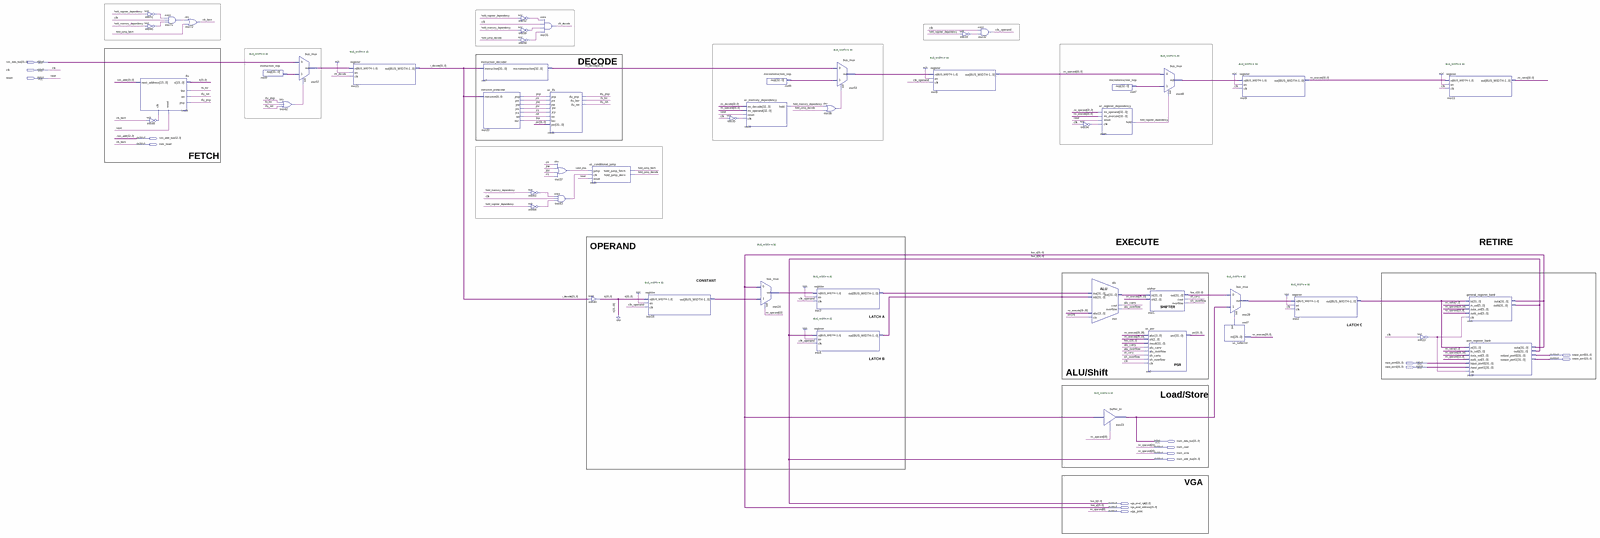
[diagram p0: schematic sheet, whole]
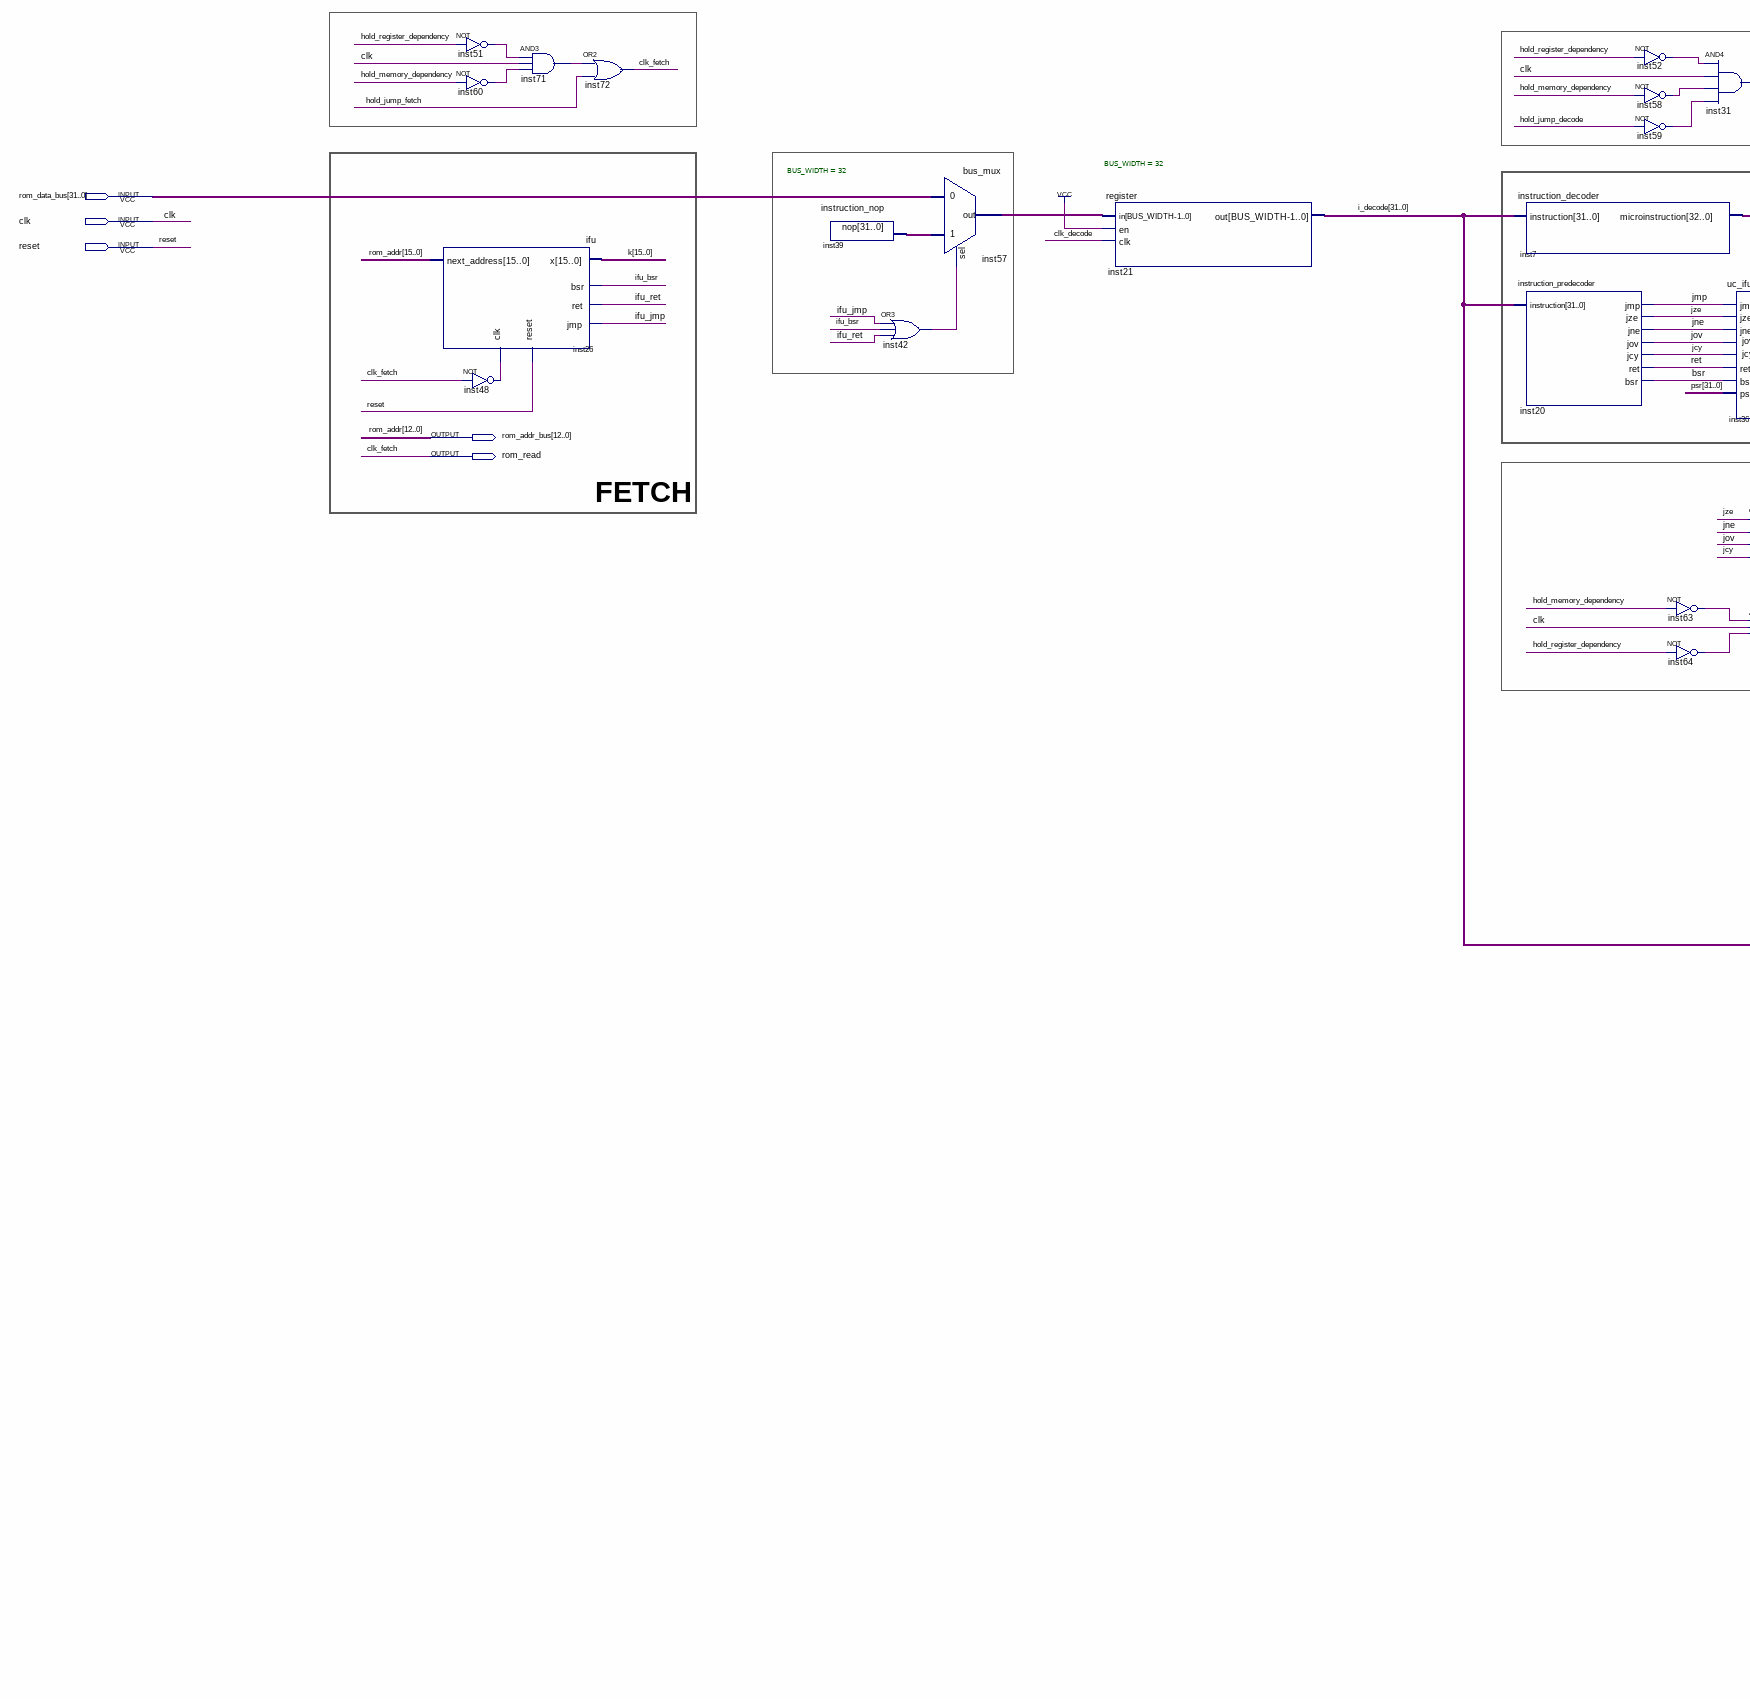
[diagram p1: schematic sheet, left part]
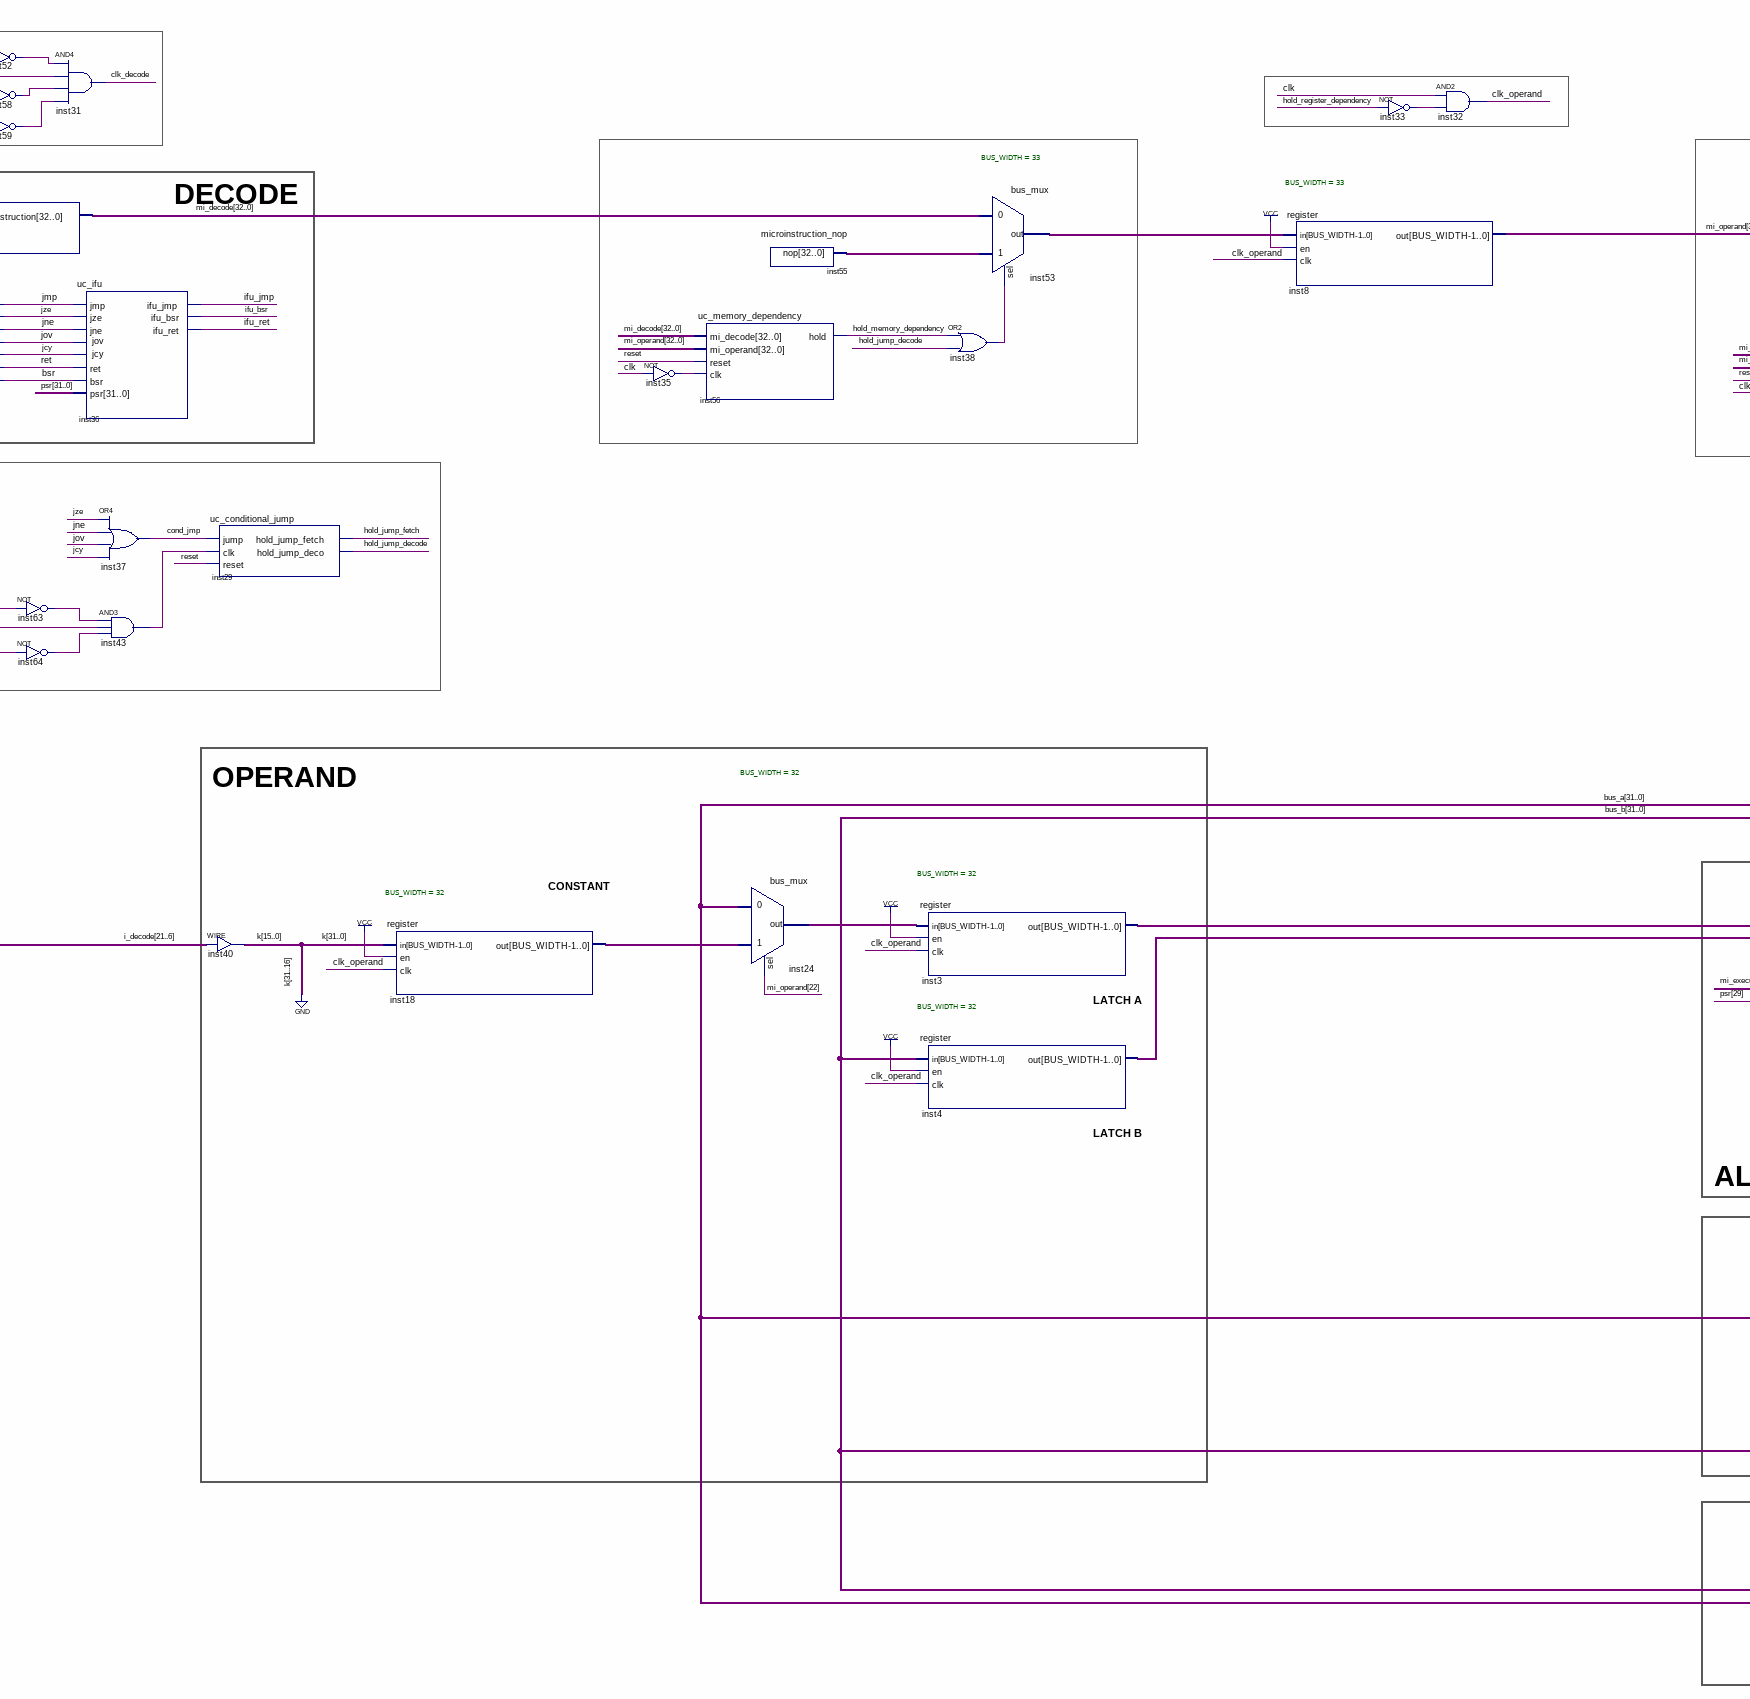
[diagram p2: schematic sheet, centre part]
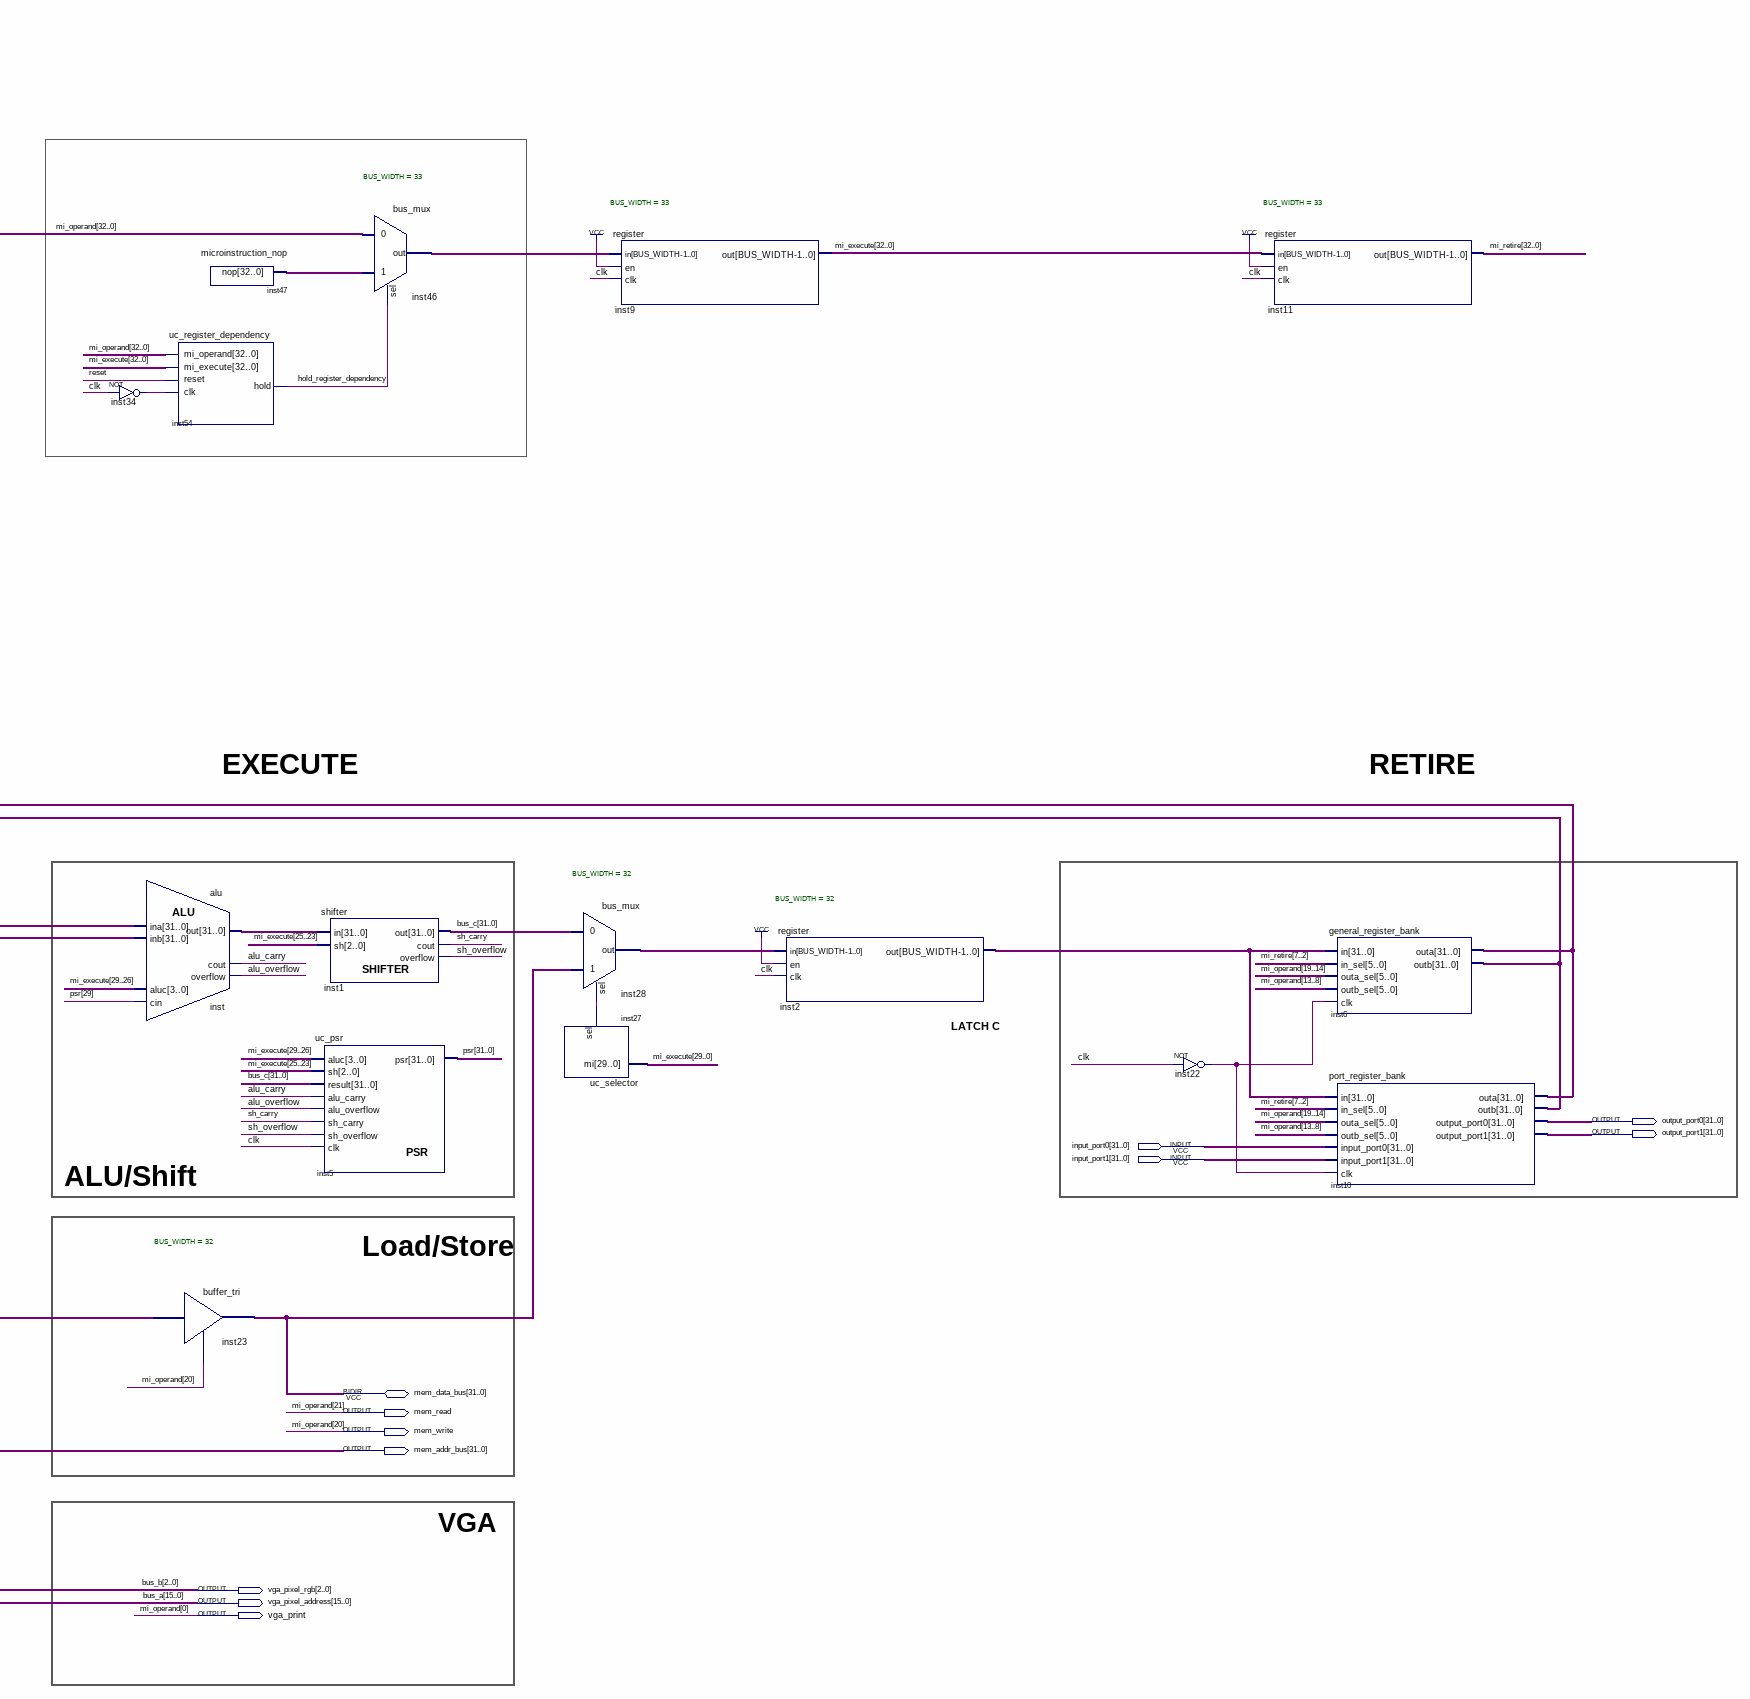
[diagram p3: schematic sheet, right part]
// Quartus schematic cpu.bdf as structural Verilog: 51 symbols, 16 pins
module cpu (
  input  [31:0] rom_data_bus,
  input  clk,
  input  reset,
  input  [31:0] input_port0,
  input  [31:0] input_port1,
  inout  [31:0] mem_data_bus,
  output [12:0] rom_addr_bus,
  output rom_read,
  output [31:0] output_port0,
  output [31:0] output_port1,
  output mem_read,
  output mem_write,
  output [31:0] mem_addr_bus,
  output [2:0] vga_pixel_rgb,
  output [15:0] vga_pixel_address,
  output vga_print
);

  wire alu_carry, alu_overflow, bsr, clk_decode, clk_operand, cond_jmp, hold_jump_decode, hold_jump_fetch,
       hold_memory_dependency, hold_register_dependency, ifu_bsr, ifu_jmp, ifu_ret, inst22_out, inst27_sel,
       inst33_out, inst34_out, inst35_out, inst38_out, inst42_out, inst43_out, inst48_out, inst51_out,
       inst52_out, inst58_out, inst59_out, inst60_out, inst63_out, inst64_out, inst71_out, jcy, jmp, jne,
       jov, jze, ret, sh_carry, sh_overflow;
  wire [15:0] k;
  wire [15:13] rom_addr;
  wire [31:0] bus_c, i_decode, inst2_out, inst3_out, inst4_out, inst18_out, inst24_out, inst28_out,
       inst39_nop, inst57_out, inst_out, psr;
  wire [31:16] bus_a;
  wire [32:0] inst46_out, inst47_nop, inst53_out, inst55_nop, mi_decode, mi_execute, mi_retire;
  wire [32:1] mi_operand;

  not inst51 (inst51_out, hold_register_dependency);
  not inst60 (inst60_out, hold_memory_dependency);
  ifu inst26 (
    .x(k), .clk(inst48_out), .bsr(ifu_bsr), .jmp(ifu_jmp), .ret(ifu_ret), .reset(reset),
    .next_address({rom_addr, rom_addr_bus}));
  not inst48 (inst48_out, rom_read);
  and inst71 (inst71_out, inst51_out, clk, inst60_out);
  or inst72 (rom_read, inst71_out, hold_jump_fetch);
  instruction_nop inst39 (.nop(inst39_nop));
  or inst42 (inst42_out, ifu_jmp, ifu_bsr, ifu_ret);
  bus_mux #(.BUS_WIDTH(32)) inst57 (.in0(rom_data_bus), .in1(inst39_nop), .sel(inst42_out), .out(inst57_out));
  register #(.BUS_WIDTH(32)) inst21 (.in(inst57_out), .en(1'b1), .clk(clk_decode), .out(i_decode));
  instruction_decoder inst7 (.instruction(i_decode), .microinstruction(mi_decode));
  instruction_predecoder inst20 (
    .instruction(i_decode), .jmp(jmp), .jze(jze), .jne(jne), .jov(jov), .jcy(jcy), .ret(ret), .bsr(bsr));
  not inst52 (inst52_out, hold_register_dependency);
  not inst58 (inst58_out, hold_memory_dependency);
  not inst59 (inst59_out, hold_jump_decode);
  not inst63 (inst63_out, hold_memory_dependency);
  not inst64 (inst64_out, hold_register_dependency);
  and inst31 (clk_decode, inst52_out, clk, inst58_out, inst59_out);
  uc_ifu inst36 (
    .jmp(jmp), .jze(jze), .jne(jne), .ret(ret), .bsr(bsr), .psr(psr), .jov(jov), .jcy(jcy),
    .ifu_jmp(ifu_jmp), .ifu_bsr(ifu_bsr), .ifu_ret(ifu_ret));
  or inst37 (cond_jmp, jze, jne, jov, jcy);
  and inst43 (inst43_out, inst63_out, clk, inst64_out);
  uc_conditional_jump inst29 (
    .jump(cond_jmp), .clk(inst43_out), .reset(reset), .hold_jump_fetch(hold_jump_fetch),
    .hold_jump_deco(hold_jump_decode));
  assign k = i_decode[21:6];  // WIRE inst40
  register #(.BUS_WIDTH(32)) inst18 (.in({{16{1'b0}}, k}), .en(1'b1), .clk(clk_operand), .out(inst18_out));
  not inst35 (inst35_out, clk);
  uc_memory_dependency inst56 (
    .mi_decode(mi_decode),
    .mi_operand({mi_operand[32:22], mem_read, mem_write, mi_operand[19:1], vga_print}), .reset(reset),
    .clk(inst35_out), .hold(hold_memory_dependency));
  microinstruction_nop inst55 (.nop(inst55_nop));
  bus_mux #(.BUS_WIDTH(32)) inst24 (
    .in0({bus_a, vga_pixel_address}), .in1(inst18_out), .sel(mi_operand[22]), .out(inst24_out));
  register #(.BUS_WIDTH(32)) inst3 (.in(inst24_out), .en(1'b1), .clk(clk_operand), .out(inst3_out));
  register #(.BUS_WIDTH(32)) inst4 (.in(mem_addr_bus), .en(1'b1), .clk(clk_operand), .out(inst4_out));
  bus_mux #(.BUS_WIDTH(33)) inst53 (.in0(mi_decode), .in1(inst55_nop), .sel(inst38_out), .out(inst53_out));
  or inst38 (inst38_out, hold_memory_dependency, hold_jump_decode);
  register #(.BUS_WIDTH(33)) inst8 (
    .in(inst53_out), .en(1'b1), .clk(clk_operand),
    .out({mi_operand[32:22], mem_read, mem_write, mi_operand[19:1], vga_print}));
  not inst33 (inst33_out, hold_register_dependency);
  and inst32 (clk_operand, clk, inst33_out);
  not inst34 (inst34_out, clk);
  alu inst (
    .ina(inst3_out), .inb(inst4_out), .aluc(mi_execute[29:26]), .cin(psr[29]), .out(inst_out),
    .cout(alu_carry), .overflow(alu_overflow));
  microinstruction_nop inst47 (.nop(inst47_nop));
  uc_register_dependency inst54 (
    .mi_operand({mi_operand[32:22], mem_read, mem_write, mi_operand[19:1], vga_print}),
    .mi_execute(mi_execute), .reset(reset), .clk(inst34_out), .hold(hold_register_dependency));
  buffer_tri #(.BUS_WIDTH(32)) inst23 (.in({bus_a, vga_pixel_address}), .en(mem_write), .out(mem_data_bus));
  shifter inst1 (.in(inst_out), .sh(mi_execute[25:23]), .out(bus_c), .cout(sh_carry), .overflow(sh_overflow));
  uc_psr inst5 (
    .aluc(mi_execute[29:26]), .sh(mi_execute[25:23]), .result(bus_c), .alu_carry(alu_carry),
    .alu_overflow(alu_overflow), .sh_carry(sh_carry), .sh_overflow(sh_overflow), .clk(clk), .psr(psr));
  bus_mux #(.BUS_WIDTH(33)) inst46 (
    .in0({mi_operand[32:22], mem_read, mem_write, mi_operand[19:1], vga_print}), .in1(inst47_nop),
    .sel(hold_register_dependency), .out(inst46_out));
  uc_selector inst27 (.mi(mi_execute[29:0]), .sel(inst27_sel));
  bus_mux #(.BUS_WIDTH(32)) inst28 (.in0(bus_c), .in1(mem_data_bus), .sel(inst27_sel), .out(inst28_out));
  register #(.BUS_WIDTH(33)) inst9 (.in(inst46_out), .en(1'b1), .clk(clk), .out(mi_execute));
  register #(.BUS_WIDTH(32)) inst2 (.in(inst28_out), .en(1'b1), .clk(clk), .out(inst2_out));
  not inst22 (inst22_out, clk);
  register #(.BUS_WIDTH(33)) inst11 (.in(mi_execute), .en(1'b1), .clk(clk), .out(mi_retire));
  general_register_bank inst6 (
    .in(inst2_out), .clk(inst22_out), .in_sel(mi_retire[7:2]), .outa_sel(mi_operand[19:14]),
    .outb_sel(mi_operand[13:8]), .outa({bus_a, vga_pixel_address}), .outb(mem_addr_bus));
  port_register_bank inst10 (
    .in(inst2_out), .input_port0(input_port0), .clk(inst22_out), .input_port1(input_port1),
    .in_sel(mi_retire[7:2]), .outa_sel(mi_operand[19:14]), .outb_sel(mi_operand[13:8]),
    .outa({bus_a, vga_pixel_address}), .outb(mem_addr_bus), .output_port0(output_port0),
    .output_port1(output_port1));

  assign vga_pixel_rgb = mem_addr_bus[2:0];

  // Other names for the same wires on the sheet: bus_a[15:0] = vga_pixel_address; bus_b[31:0] = mem_addr_bus;
  //   clk_fetch = rom_read; mi_operand (some bits) = {mem_read, mem_write, vga_print}; rom_addr[12:0] = rom_addr_bus

  // Notes on the sheet:
  //   DECODE
  //   FETCH
  //   EXECUTE
  //   RETIRE
  //   OPERAND
  //   CONSTANT
  //   LATCH A
  //   LATCH C
  //   LATCH B
  //   ALU/Shift
  //   Load/Store
  //   VGA
endmodule
